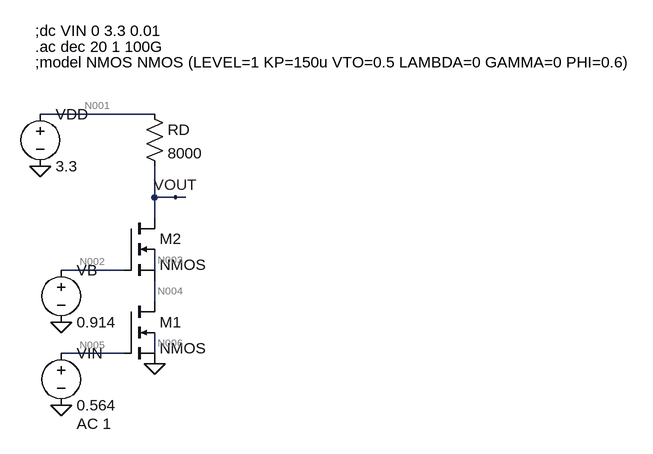
[diagram p0: schematic E3b.asc]
E3b.asc, the LTspice schematic file:
Version 4
SHEET 1 892 680
WIRE 96 -256 -80 -256
WIRE 96 -128 96 -176
WIRE 128 -128 96 -128
WIRE 144 -128 128 -128
WIRE 96 -96 96 -128
WIRE 48 -16 -48 -16
WIRE 96 -16 96 -48
WIRE 96 32 96 0
WIRE 48 112 -48 112
WIRE 96 112 96 80
FLAG 96 128 0
FLAG -48 64 0
FLAG -48 192 0
FLAG -80 -176 0
FLAG 128 -128 VOUT
SYMBOL nmos4 48 32 R0
SYMATTR InstName M1
SYMATTR Value2 l=0.18u w=18u
SYMBOL nmos4 48 -96 R0
SYMATTR InstName M2
SYMATTR Value2 l=0.36u w=18u
SYMBOL res 80 -272 R0
SYMATTR InstName RD
SYMATTR Value 8000
SYMBOL voltage -80 -272 R0
WINDOW 123 0 0 Left 0
WINDOW 39 0 0 Left 0
SYMATTR InstName VDD
SYMATTR Value 3.3
SYMBOL voltage -48 -32 R0
WINDOW 123 0 0 Left 0
WINDOW 39 0 0 Left 0
SYMATTR InstName VB
SYMATTR Value 0.914
SYMBOL voltage -48 96 R0
WINDOW 123 24 124 Left 2
WINDOW 39 0 0 Left 0
SYMATTR Value2 AC 1
SYMATTR InstName VIN
SYMATTR Value 0.564
TEXT -88 -384 Left 2 !;dc VIN 0 3.3 0.01
TEXT -88 -360 Left 2 !.ac dec 20 1 100G
TEXT -88 -336 Left 2 !;model NMOS NMOS (LEVEL=1 KP=150u VTO=0.5 LAMBDA=0 GAMMA=0 PHI=0.6)

The netlist it stands for:
* E3b.asc
M1 N004 N005 0 N006 NMOS l=0.18u w=18u
M2 VOUT N002 N004 N003 NMOS l=0.36u w=18u
RD N001 VOUT 8000
VDD N001 0 3.3
VB N002 0 0.914
VIN N005 0 0.564 AC 1
.model NMOS NMOS
.model PMOS PMOS
.lib standard.mos
;dc VIN 0 3.3 0.01
.ac dec 20 1 100G
;model NMOS NMOS (LEVEL=1 KP=150u VTO=0.5 LAMBDA=0 GAMMA=0 PHI=0.6)
.backanno
.end

* Results of the author's LTspice run, read from the files saved beside the schematic
* Operating Point, zero values left out:
*   V(n004) = 250.7 mV
*   V(n005) = 564 mV
*   V(n006) = 58.39 mV
*   V(vout) = 1.54 V
*   V(n002) = 914 mV
*   V(n003) = 361.6 mV
*   V(n001) = 3.3 V
*   Id(M2) = 220 µA
*   Is(M2) = -220 µA
*   Id(M1) = 220 µA
*   Is(M1) = -220 µA
*   I(Rd) = 220 µA
*   I(Vdd) = -220 µA